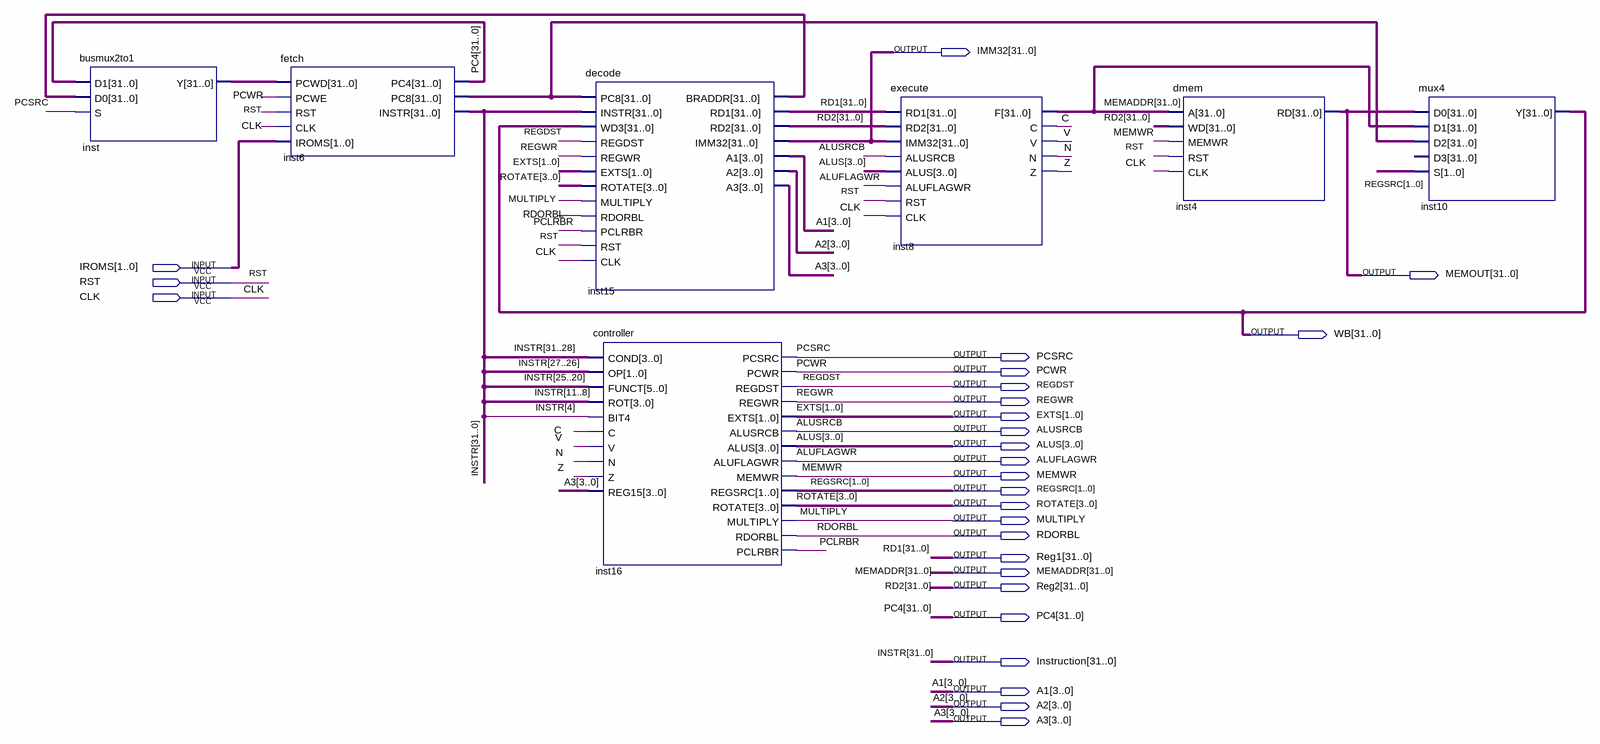
[diagram p0: schematic sheet]
// Quartus schematic SPC.bdf as structural Verilog: 7 symbols, 27 pins
module SPC (
  input  [1:0] IROMS,
  input  RST,
  input  CLK,
  output [31:0] IMM32,
  output [31:0] MEMOUT,
  output [31:0] WB,
  output PCSRC,
  output PCWR,
  output REGDST,
  output REGWR,
  output [1:0] EXTS,
  output ALUSRCB,
  output [3:0] ALUS,
  output ALUFLAGWR,
  output MEMWR,
  output [1:0] REGSRC,
  output [3:0] ROTATE,
  output MULTIPLY,
  output RDORBL,
  output [31:0] Reg1,
  output [31:0] MEMADDR,
  output [31:0] Reg2,
  output [31:0] PC4,
  output [31:0] Instruction,
  output [3:0] A1,
  output [3:0] A2,
  output [3:0] A3
);

  wire C, N, PCLRBR, V, Z;
  wire [31:0] inst6_pc8, inst15_braddr, inst_y;

  busmux2to1 inst (.D1(PC4), .D0(inst15_braddr), .S(PCSRC), .Y(inst_y));
  fetch inst6 (
    .PCWD(inst_y), .PCWE(PCWR), .RST(RST), .CLK(CLK), .IROMS(IROMS), .PC4(PC4), .PC8(inst6_pc8),
    .INSTR(Instruction));
  decode inst15 (
    .PC8(inst6_pc8), .INSTR(Instruction), .WD3(WB), .REGDST(REGDST), .REGWR(REGWR), .EXTS(EXTS),
    .ROTATE(ROTATE), .MULTIPLY(MULTIPLY), .RDORBL(RDORBL), .PCLRBR(PCLRBR), .RST(RST), .CLK(CLK),
    .BRADDR(inst15_braddr), .RD1(Reg1), .RD2(Reg2), .IMM32(IMM32), .A1(A1), .A2(A2), .A3(A3));
  controller inst16 (
    .COND(Instruction[31:28]), .OP(Instruction[27:26]), .FUNCT(Instruction[25:20]), .ROT(Instruction[11:8]),
    .BIT4(Instruction[4]), .C(C), .V(V), .N(N), .Z(Z), .REG15(A3), .PCSRC(PCSRC), .PCWR(PCWR),
    .REGDST(REGDST), .REGWR(REGWR), .EXTS(EXTS), .ALUSRCB(ALUSRCB), .ALUS(ALUS), .ALUFLAGWR(ALUFLAGWR),
    .MEMWR(MEMWR), .REGSRC(REGSRC), .ROTATE(ROTATE), .RDORBL(RDORBL), .PCLRBR(PCLRBR), .MULTIPLY(MULTIPLY));
  execute inst8 (
    .RD1(Reg1), .RD2(Reg2), .IMM32(IMM32), .ALUSRCB(ALUSRCB), .ALUS(ALUS), .ALUFLAGWR(ALUFLAGWR), .RST(RST),
    .CLK(CLK), .F(MEMADDR), .C(C), .V(V), .N(N), .Z(Z));
  dmem inst4 (.A(MEMADDR), .WD(Reg2), .MEMWR(MEMWR), .RST(RST), .CLK(CLK), .RD(MEMOUT));
  mux4 inst10 (.D0(MEMOUT), .D1(MEMADDR), .D2(inst6_pc8), .S(REGSRC), .Y(WB));  // open: D3

  // Other names for the same wires on the sheet: INSTR[31:0] = Instruction; RD1[31:0] = Reg1; RD2[31:0] = Reg2
endmodule
